# Altium schematic sheet UI_Ticketing_Slave.SchDoc
size A4; Author: Mario Dos Santos; Organization: ETML-ES; Address1: Avenue Recordon 1; Address2: 1004 Lausanne; Address3: Switzerland; SheetNumber: 4; SheetTotal: 5
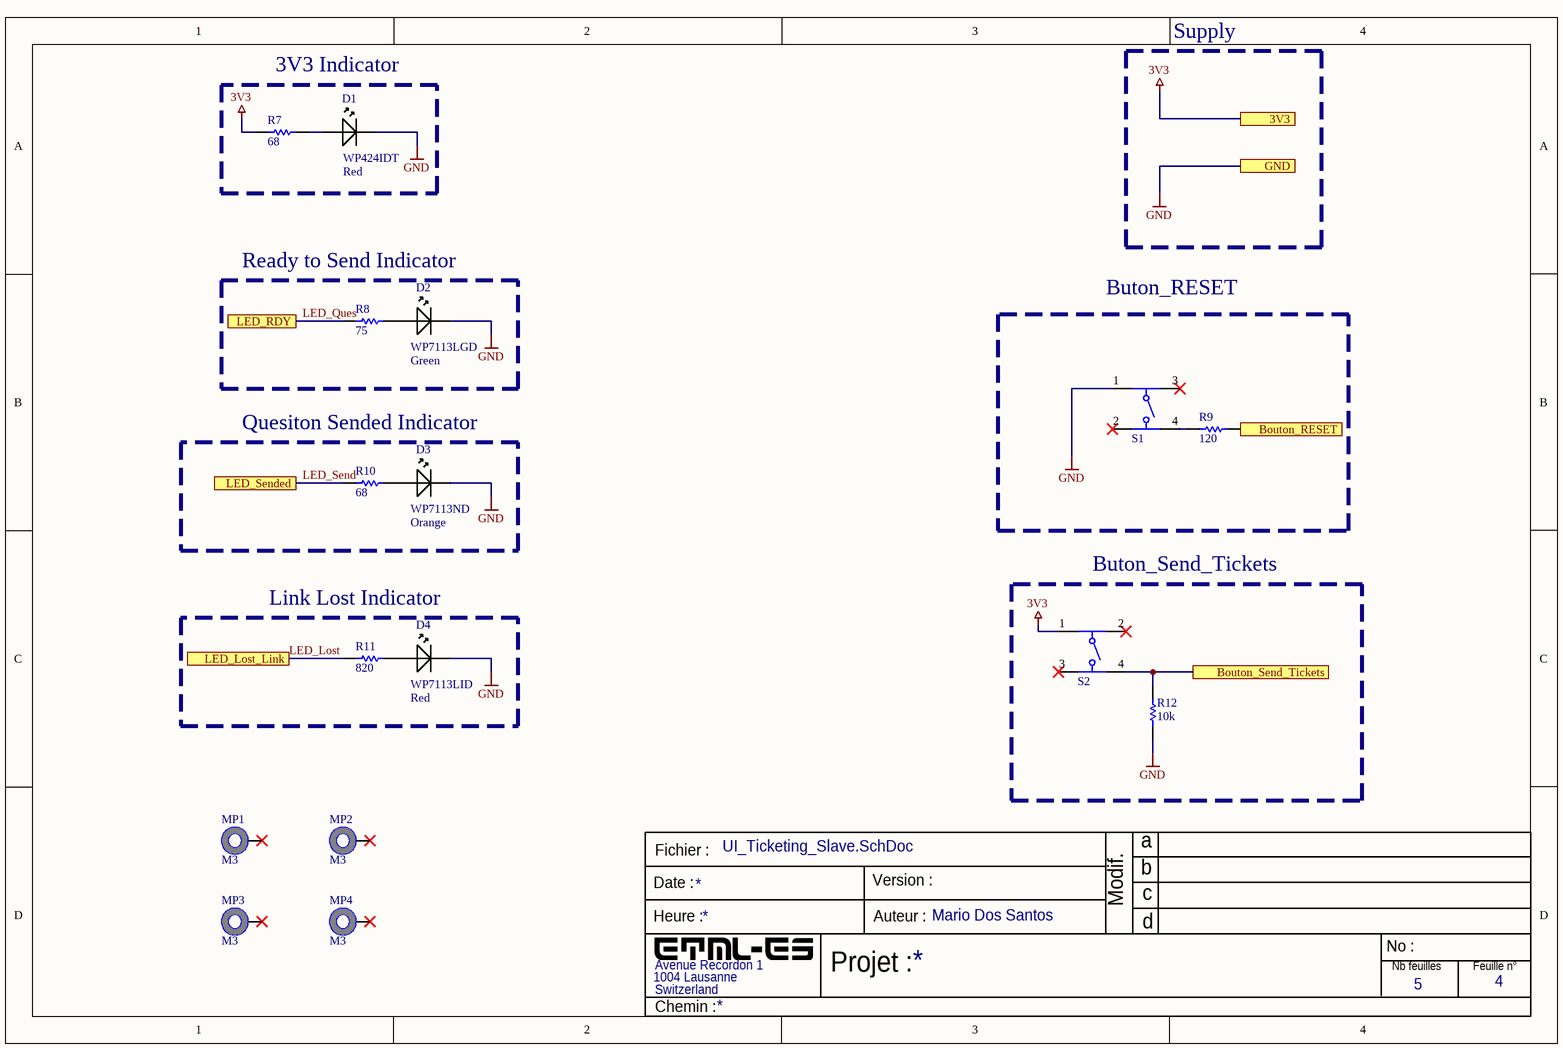
[diagram p0: UI_Ticketing_Slave.SchDoc]

## Parts
D1  WP424IDT  Color: Red  [LED-2P-2.28-3MM]
D2  WP7113LGD  Color: Green  [Type 5mm]
D3  WP7113ND  Color: Orange  [Type 5mm]
D4  WP7113LID  Color: Red  [Type 5mm]
MP1  M3  [9774010151]
MP2  M3  [9774010151]
MP3  M3  [9774010151]
MP4  M3  [9774010151]
R7  68  [RESC0805(2012)_L]
R8  75  [RESC0805(2012)_L]
R9  120  [RESC0805(2012)_L]
R10  68  [RESC0805(2012)_L]
R11  820  [RESC0805(2012)_L]
R12  10k  [RESC0805(2012)_L]
S1  430182050816  [430182050816]  (value not drawn)
S2  430466073726  [4304x60737x6_12x12x7.3]  (value not drawn)

## Blocks framed on the sheet
3V3 Indicator: D1 R7
Ready to Send Indicator: D2 R8
Buton_RESET: R9 S1
Quesiton Sended Indicator: D3 R10
Link Lost Indicator: D4 R11
Buton_Send_Tickets: R12 S2

## Ports
3V3, Bouton_RESET, Bouton_Send_Tickets, GND, LED_Lost_Link, LED_RDY, LED_Sended

## Nets
3V3: R7.2 S2.1 ; port 3V3
GND: D1.2(Cathode) D2.1(Cathode) D3.1(Cathode) D4.1(Cathode) R12.2 S1.1 ; port GND
Bouton_RESET: R9.2 ; port Bouton_RESET
Bouton_Send_Tickets: R12.1 S2.4 ; port Bouton_Send_Tickets
LED_Lost: R11.2 ; port LED_Lost_Link
LED_Ques: R8.2 ; port LED_RDY
LED_Send: R10.2 ; port LED_Sended
NetD1_1: D1.1(Anode) R7.1
NetD2_2: D2.2(Anode) R8.1
NetD3_2: D3.2(Anode) R10.1
NetD4_2: D4.2(Anode) R11.1
NetR9_1: R9.1 S1.4

Not connected (* = marked no-connect by the designer): MP1 1*; MP2 1*; MP3 1*; MP4 1*; S1 2* 3*; S2 2* 3*

## Notes on the sheet
- Supply
- Fichier :
- a
- Date :
- Heure :
- Version :
- Auteur :
- Modif.
- b
- c
- d
- Projet :
- No :
- Nb feuilles
- Feuille n°
- Chemin :

## Library data of the parts
D1-D4 = LED: Supplier: Digi-Key
  D1: Supplier Part Number: 754-1305-ND; Supplier unit price: 0.4; Value: WP424IDT
  D2: Supplier Part Number: 754-1265-ND; Supplier unit price: 0.33; Value: WP7113LGD
  D3: Supplier Part Number: 754-1896-ND; Supplier unit price: 0.3; Value: WP7113ND
  D4: Supplier Part Number: 754-1266-ND; Supplier unit price: 0.33; Value: WP7113LID
MP1-MP4 = 9774010151: WA-SMSI SMT Steel Spacer, M2.5 Thread Internal, Length 1mm; Supplier: Digi-Key
R7 R8 R12 = CMP-1013-00122-1: 100K 0.125W 5% 0805 (2012 Metric)  SMD; Supplier: Digi-Key; Supplier unit price: 0.1
  R7: Value: 68; Supplier Part Number: RMCF0805JT68R0CT-ND
  R8: Value: 75; Supplier Part Number: A126386CT-ND
  R12: Value: 10k; Supplier Part Number: 311-10KLGCT-ND
R9 = CMP-1013-00122-1: 100K 0.125W 5% 0805 (2012 Metric)  SMD; Value: 10k; Supplier: Digi-Key; Supplier Part Number: A129738CT-ND; Supplier unit price: 0.1
R10 R11 = CMP-1013-00122-1: 100K 0.125W 5% 0805 (2012 Metric)  SMD; Value: 680; Supplier: Digi-Key; Supplier unit price: 0.1
  R10: Supplier Part Number: RMCF0805JT68R0CT-ND
  R11: Supplier Part Number: A129748CT-ND
S1 = 430182050816: 6x6mm SMD Tact Switch WS-TASV, height 5 mm, 160 gf; Supplier: Digi-Key; Supplier Part Number: 732-7005-1-ND; Supplier unit price: 0.51; Value: 430182050816
S2 = 430466073726: WS-TATV 12x12mm washable Tact Switch, THT version; Supplier: Digi-Key; Supplier Part Number: 430466073726-ND; Supplier unit price: 0.56; Value: 430466073726